# EAGLE design GAGAN_payload_V5 (EAGLE 9.3.2)
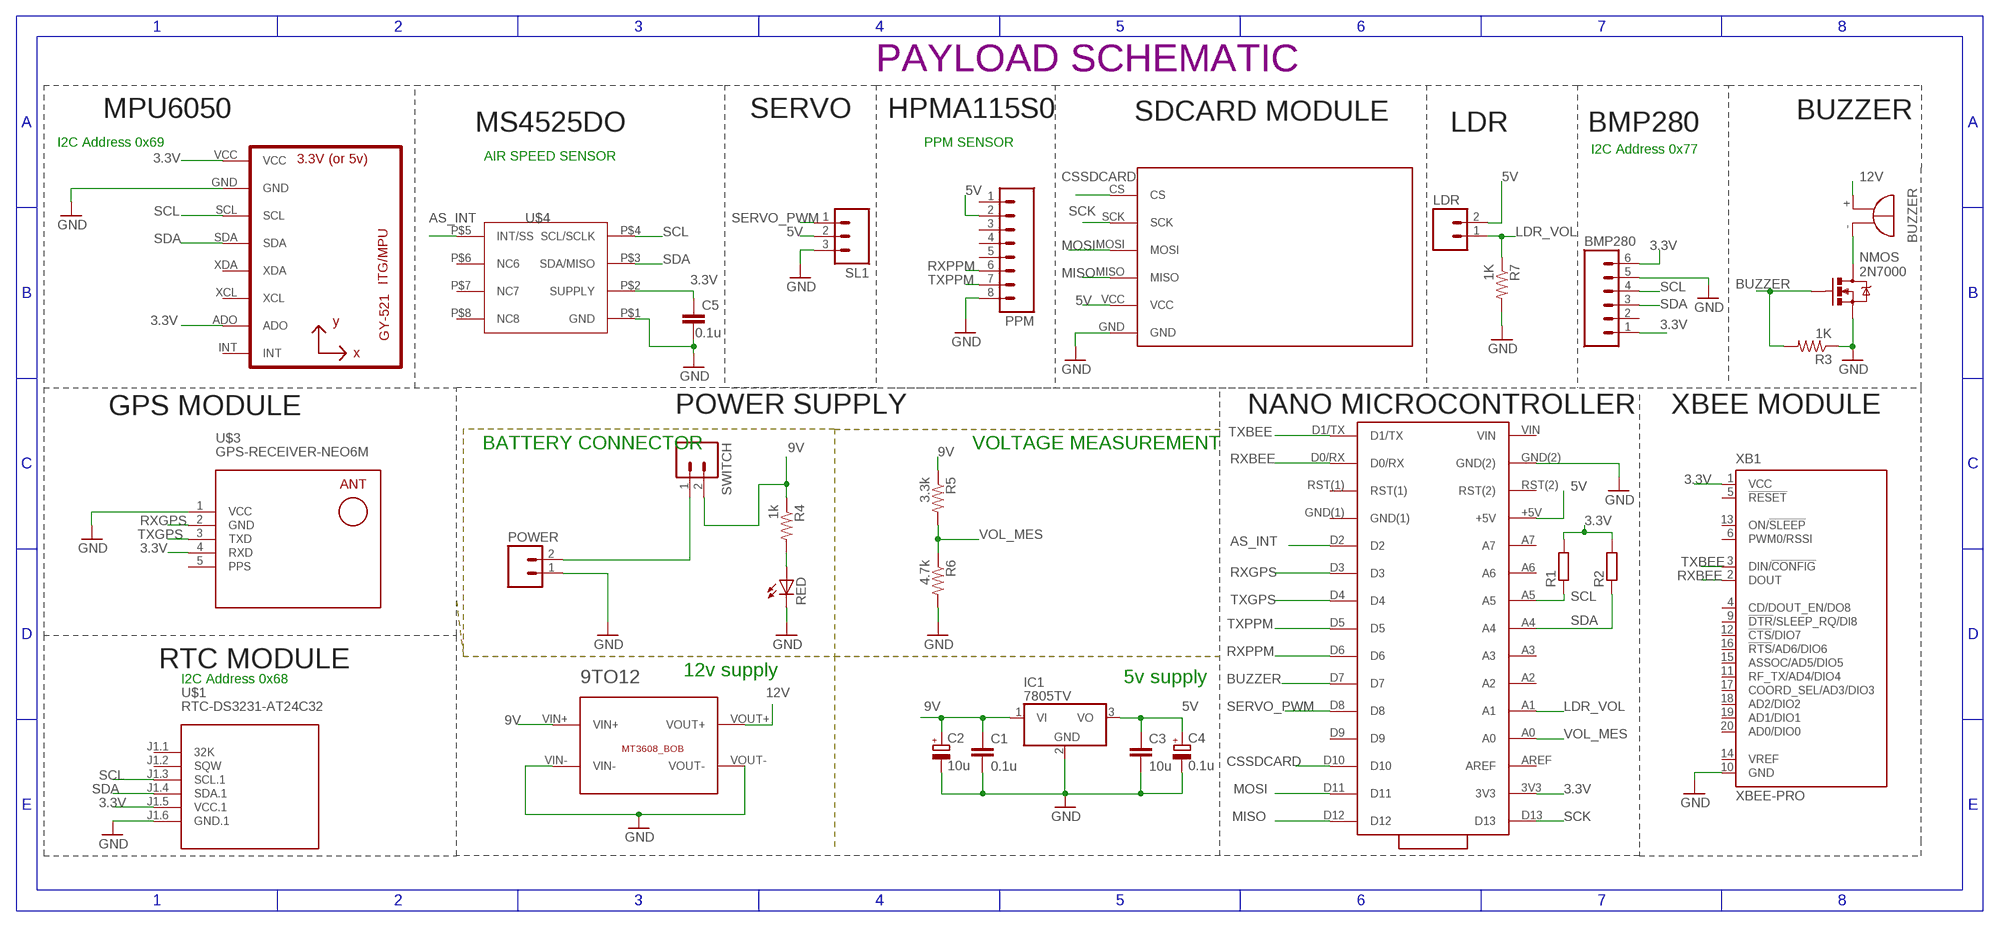
[diagram p0: schematic, sheet 1]

## Parts
9TO12  BREAKOUTS_MT3608_BOB  [BREAKOUTS_MT3608_BOB]
BMP280  M06  [06P]
C1  0.1u  C-EU025-025X050  [C025-025X050]
C2  10u  CPOL-EUE2.5-6  [E2,5-6]
C3  10u  C-EU025-025X050  [C025-025X050]
C4  0.1u  CPOL-EUE2.5-6  [E2,5-6]
C5  0.1u  C-EU025-025X050  [C025-025X050]
IC1  7805TV  [TO220V]
LDR  M02  [02P]
MOD1  ARDUINO(NANO_3.0)  [ARDUINO_NANO_30PIN]
POWER  CEDT_JANUARY_2015_V5_M02  [CEDT_JANUARY_2015_V5_02P]
PPM  M08  [08P]
Q1  SPARKFUN-DISCRETESEMI_MOSFET-NCHANNEL2N7000  [SPARKFUN-DISCRETESEMI_TO-92]
R1  R-EU_0207/7  [0207/7]
R2  R-EU_0207/7  [0207/7]
R3  1K  R-US_0204/7  [0204/7]
R4  1k  R-US_0204/7  [0204/7]
R5  3.3k  R-US_0204/7  [0204/7]
R6  4.7k  R-US_0204/7  [0204/7]
R7  1K  R-US_0204/7  [0204/7]
RED  red  LED3MM  [LED3MM]
SG1  BUZZER_EB2209A  [BUZZER_EB2209A]
SL1  M03  [03P]
SWITCH  M02  [02P]
U1  GY-521MPU6050  [GY-521]
U$1  RTC-DS3231-AT24C32  [RTC-DS3231-AT24C32]
U$3  GPS-RECEIVER-NEO6M  [GPS-RECEIVER-NEO6M]
U$4  MS4525DO  [MS4525DO]
U$5  SDCARD  [M0SDCARDMODULE]
XB1  XBEE-PRO  [XBEE-PRO]

## Nets
3.3V [power]: BMP280.1 BMP280.6 C5.1 MOD1.3V3 R1.2 R2.2 U1.ADO U1.VCC U$1.J1.5(VCC.1) U$3.4(RXD) U$4.P$2(SUPPLY) XB1.1(VCC)
5V [power]: C3.1 C4.+ IC1.3(VO) LDR.2 MOD1.+5V PPM.2 SL1.2 U$5.VCC
9V [power]: 9TO12.VIN+ C1.1 C2.+ IC1.1(VI) R4.1 R5.1 SWITCH.2
12V [power]: 9TO12.VOUT+ SG1.+
AS_INT: MOD1.D2 U$4.P$5(INT/SS)
BUZZER: MOD1.D7 Q1.2(G) R3.2
CSSDCARD: MOD1.D10 U$5.CS
GND [power]: 9TO12.VIN- 9TO12.VOUT- BMP280.5 C1.2 C2.- C3.2 C4.- C5.2 IC1.2(GND) MOD1.GND(2) POWER.1 PPM.8 Q1.1(S) R3.1 R6.2 R7.2 RED.K(C) SL1.3 U1.GND U$1.J1.6(GND.1) U$3.1(VCC) U$4.P$1(GND) U$5.GND XB1.10(GND)
LDR_VOL: LDR.1 MOD1.A1 R7.1
MISO: MOD1.D12 U$5.MISO
MOSI: MOD1.D11 U$5.MOSI
N$1 [power]: POWER.2 SWITCH.1
N$2: R4.2 RED.A
N$3 [power]: Q1.3(D) SG1.-
RXBEE: MOD1.D0/RX XB1.2(DOUT)
RXGPS: MOD1.D3 U$3.2(GND)
RXPPM: MOD1.D6 PPM.6
SCK: MOD1.D13 U$5.SCK
SCL: BMP280.4 MOD1.A5 R1.1 U1.SCL U$1.J1.3(SCL.1) U$4.P$4(SCL/SCLK)
SDA: BMP280.3 MOD1.A4 R2.1 U1.SDA U$1.J1.4(SDA.1) U$4.P$3(SDA/MISO)
SERVO_PWM: MOD1.D8 SL1.1
TXBEE: MOD1.D1/TX XB1.3(DIN/!CONFIG)
TXGPS: MOD1.D4 U$3.3(TXD)
TXPPM: MOD1.D5 PPM.7
VOL_MES: MOD1.A0 R5.2 R6.1
Unconnected: BMP280.2 MOD1.A2 MOD1.A3 MOD1.A6 MOD1.A7 MOD1.AREF MOD1.D9 MOD1.GND(1) MOD1.RST(1) MOD1.RST(2) MOD1.VIN PPM.1 PPM.3 PPM.4 PPM.5 U1.INT U1.XCL U1.XDA U$1.J1.1(32K) U$1.J1.2(SQW) U$4.P$6(NC6) U$4.P$7(NC7) U$4.P$8(NC8) XB1.4(CD/DOUT_EN/DO8) XB1.5(!RESET) XB1.6(PWM0/RSSI) XB1.9(!DTR!/SLEEP_RQ/DI8) XB1.11(RF_TX/AD4/DIO4) XB1.12(!CTS!/DIO7) XB1.13(ON/!SLEEP) XB1.14(VREF) XB1.15(ASSOC/AD5/DIO5) XB1.16(!RTS!/AD6/DIO6) XB1.17(COORD_SEL/AD3/DIO3) XB1.18(AD2/DIO2) XB1.19(AD1/DIO1) XB1.20(AD0/DIO0)

## Notes on the sheet
- PAYLOAD SCHEMATIC
- MPU6050 | SERVO | HPMA115S0 | SDCARD MODULE | BUZZER
- MS4525DO | LDR | BMP280
- I2C Address 0x69 | PPM SENSOR
- I2C Address 0x77
- AIR SPEED SENSOR
- GPS MODULE | POWER SUPPLY | NANO MICROCONTROLLER | XBEE MODULE
- BATTERY CONNECTOR | VOLTAGE MEASUREMENT
- RTC MODULE
- 12v supply
- I2C Address 0x68 | 5v supply

## Power pins joined to a net without a drawn wire
PPS: U$3.5(PPS)

## Library data of the parts
9TO12 = Cansat2019_3279_Container_v01:BREAKOUTS_MT3608_BOB
BMP280 = con-amp-quick:M06: AMP QUICK CONNECTOR; OC_FARNELL: unknown; OC_NEWARK: unknown
C1 C3 C5 = resistor:C-EU: CAPACITOR, European symbol
C2 C4 = rcl:CPOL-EU: POLARIZED CAPACITOR, European symbol
IC1 = linear:78*: Positive VOLTAGE REGULATOR Source: http://cache.national.com/ds/LM/LM78L05.pdf http://www.fairchildsemi.com/ds/LM/LM7805.pdf
LDR = con-amp-quick:M02: AMP QUICK CONNECTOR; OC_FARNELL: unknown; OC_NEWARK: unknown
MOD1 = Arduino_Nano_3:ARDUINO(NANO_3.0)
POWER = Cansat2019_3279_Container_v01:CEDT_JANUARY_2015_V5_M02: AMP QUICK CONNECTOR
PPM = con-amp-quick:M08: AMP QUICK CONNECTOR; OC_FARNELL: unknown; OC_NEWARK: unknown
Q1 = Cansat2019_3279_Container_v01:SPARKFUN-DISCRETESEMI_MOSFET-NCHANNEL: Common NMOSFET Parts MFG P/N Store ID Prod ID FDD8780 TRANS-09984 SI7820DN TRANS-11055 FDS6630A IC-08089 2N7002PW TRANS-11151 FQP30N06L COM-10213 TRANS-10060 BSS123LT1G TRANS-08345 BSS138 TRANS-00830 BS170 2N7000
R1 R2 = rcl:R-EU_: RESISTOR, European symbol; SPICEPREFIX: R
R3-R7 = rcl:R-US_: RESISTOR, American symbol
RED = CEDT_JANUARY_2015_v5:LED
SG1 = Cansat2019_3279_Container_v01:BUZZER_EB2209A: BUZZER Source: Buerklin; OC_FARNELL: unknown; OC_NEWARK: unknown
SL1 = con-amp-quick:M03: AMP QUICK CONNECTOR; OC_FARNELL: unknown; OC_NEWARK: unknown
SWITCH = CEDT_JANUARY_2015_v5:M02: AMP QUICK CONNECTOR
U1 = gy-521:GY-521
U$1 = diy-modules:RTC-DS3231-AT24C32: RTC Module with Battery and EEPROM based on DS3231 and AT24C32 chips Tutorial can be found here: https://edwardmallon.wordpress.com/2014/05/21/using-a-cheap-3-ds3231-rtc-at24c32-eeprom-from-ebay/ Click here to find device on ebay.com <http://www.ebay.com/sch/DS3231+AT24C32+module>
U$3 = diy-modules:GPS-RECEIVER-NEO6M: GPS Receiver Module based on NEO-6 device Short tutorial how to use NEO-6 module with Arduino: http://www.xarg.org/2016/06/neo6mv2-gps-module-with-arduino/ NEO-6 datasheet is available here: https://www.u-blox.com/sites/default/files/products/documents/NEO-6_DataSheet_%28GPS.G6-HW-09005%29.pdf Click here to find device on ebay.com <http://www.ebay.com/sch/gyneo6mv2>
U$4 = MS4525:MS4525DO
U$5 = mylib:SDCARD
XB1 = maxstream:XBEE: XBee (TM) /XBee-PRO(TM) OEM RF Modules Source: MaxStream, Inc. xbee_productmanual.pdf; MPN: XBP24-AWI-001; OC_FARNELL: 1337916; OC_NEWARK: 42M2667

## Net classes
0 default: width 0.61 mm
1 power: width 0.61 mm

## Board
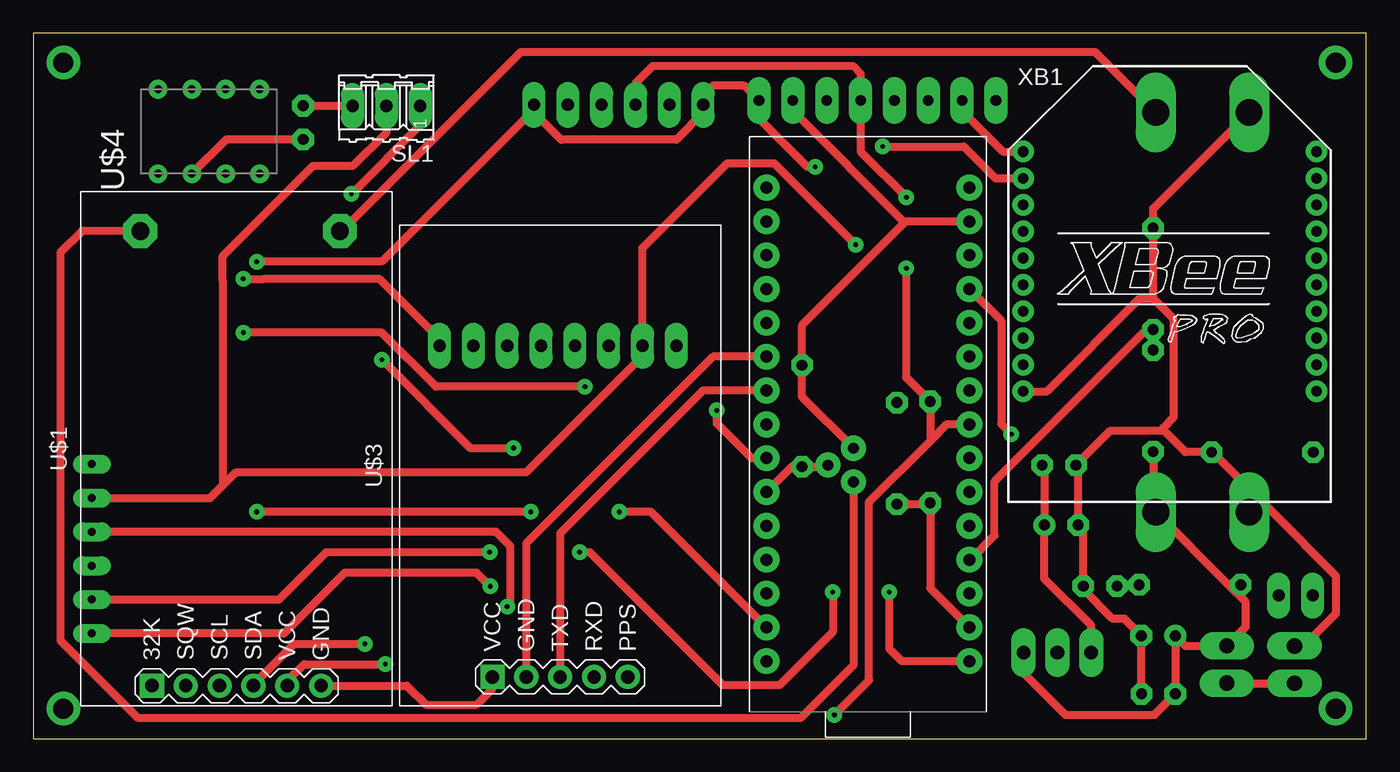
[diagram p1: board, top side]
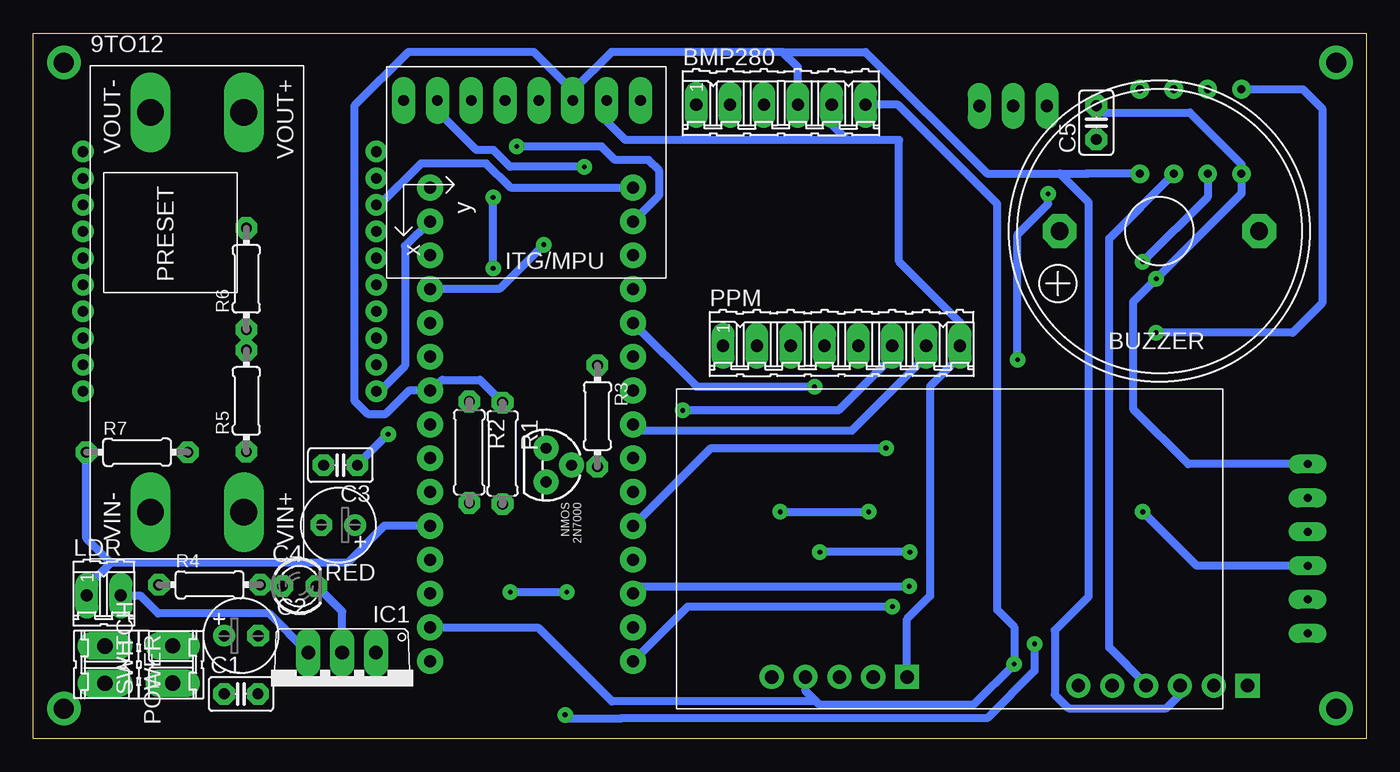
[diagram p2: board, bottom side, seen from below]

Size 100.04 x 52.95 mm. Coordinates in mm from the lower left corner, seen from the top.
Outline: 0,0 100.04,0 100.04,52.95 0,52.95 0,0
Copper layers (1*16): Top 0.035mm / dielectric 1.5mm / Bottom 0.035mm
Design rules "default *": minimum track width 6mil, minimum drill 0.35mm, track to track 16mil, track to pad 16mil, pad to pad 16mil, via to via 16mil, smd to smd 16mil, copper to edge 40mil, drill to drill 6mil, minimum pad ring 16mil, minimum via ring 16mil, stop-mask expansion 4mil, vias tented up to drill 0mil, thermal gap 10mil

### Footprints (pad centres in the part's own frame; a part is rotated, then mirrored left to right if it is on the bottom)
BREAKOUTS_MT3608_BOB = drill 2 pad 3 long: VIN+ 33.5,-4.5; VIN- 33.5,-11.5; VOUT+ 3.5,-4.5; VOUT- 3.5,-11.5
06P = drill 0.914 long: 1 -6.35,0; 2 -3.81,0; 3 -1.27,0; 4 1.27,0; 5 3.81,0; 6 6.35,0
C025-025X050 = drill 0.813 octagon: 1 -1.27,0; 2 1.27,0
E2,5-6 = drill 0.813 pad 1.6: + -1.27,0 | drill 0.813 pad 1.6 octagon: - 1.27,0
TO220V = drill 1.016 long: 1 -2.54,-2.54; 2 0,-2.54; 3 2.54,-2.54
02P = drill 0.914 long: 1 -1.27,0; 2 1.27,0
ARDUINO_NANO_30PIN = drill 0.9 pad 1.93: 3V3 16.51,6.35; +5V 16.51,31.75; A0 16.51,11.43; A1 16.51,13.97; A2 16.51,16.51; A3 16.51,19.05; A4 16.51,21.59; A5 16.51,24.13; A6 16.51,26.67; A7 16.51,29.21; AREF 16.51,8.89; D0/RX 1.27,36.83; D1/TX 1.27,39.37; D2 1.27,29.21; D3 1.27,26.67; D4 1.27,24.13; D5 1.27,21.59; D6 1.27,19.05; D7 1.27,16.51; D8 1.27,13.97; D9 1.27,11.43; D10 1.27,8.89; D11 1.27,6.35; D12 1.27,3.81; D13 16.51,3.81; GND(1) 1.27,31.75; GND(2) 16.51,36.83; RST(1) 1.27,34.29; RST(2) 16.51,34.29; VIN 16.51,39.37
CEDT_JANUARY_2015_V5_02P = drill 1.143 long: 1 -1.397,0; 2 1.397,0
08P = drill 0.914 long: 1 -8.89,0; 2 -6.35,0; 3 -3.81,0; 4 -1.27,0; 5 1.27,0; 6 3.81,0; 7 6.35,0; 8 8.89,0
SPARKFUN-DISCRETESEMI_TO-92 = drill 0.813 pad 1.88: 1 -1.27,0; 2 0,1.905; 3 1.27,0
0207/7 = drill 0.813 octagon: 1 -3.81,0; 2 3.81,0
0204/7 = drill 0.813 octagon: 1 -3.81,0; 2 3.81,0
LED3MM = drill 0.813 octagon: A -1.27,0; K 1.27,0
BUZZER_EB2209A = drill 1.321 pad 2.54 octagon: + 7.493,0; - -7.493,0
03P = drill 0.914 long: 1 -2.54,0; 2 0,0; 3 2.54,0
02P' = drill 1.143 long: 1 -1.397,0; 2 1.397,0
GY-521 = drill 0.8 pad 1.778 long: ADO -8.89,-6.35; GND -8.89,6.35; INT -8.89,-8.89; SCL -8.89,3.81; SDA -8.89,1.27; VCC -8.89,8.89; XCL -8.89,-3.81; XDA -8.89,-1.27
RTC-DS3231-AT24C32 = drill 1 square: J1.1 -17.78,6.35 | drill 1: J1.2 -17.78,3.81; J1.3 -17.78,1.27; J1.4 -17.78,-1.27; J1.5 -17.78,-3.81; J1.6 -17.78,-6.35
GPS-RECEIVER-NEO6M = drill 1 square: 1 -15.875,5.08 | drill 1: 2 -15.875,2.54; 3 -15.875,0; 4 -15.875,-2.54; 5 -15.875,-5.08
MS4525DO = drill 0.6: P$1 -6.35,8.89; P$2 -6.35,6.35; P$3 -6.35,3.81; P$4 -6.35,1.27; P$5 0,8.89; P$6 0,6.35; P$7 0,3.81; P$8 0,1.27
M0SDCARDMODULE = drill 0.6 long: CS -6.35,6.35; GND -6.35,-6.35; MISO -6.35,-1.27; MOSI -6.35,1.27; SCK -6.35,3.81; VCC -6.35,-3.81
XBEE-PRO = drill 0.8 pad 1.27: 1 -11,9; 2 -11,7; 3 -11,5; 4 -11,3; 5 -11,1; 6 -11,-1; 7 -11,-3; 8 -11,-5; 9 -11,-7; 10 -11,-9; 11 11,-9; 12 11,-7; 13 11,-5; 14 11,-3; 15 11,-1; 16 11,1; 17 11,3; 18 11,5; 19 11,7; 20 11,9

### Placement (x,y rotation side)
9TO12  79.75,50.5 270 bottom
BMP280  43.93,47.58 0 bottom
C1  84.45,3.35 0 bottom
C2  84.44,7.72 0 bottom
C3  76.99,20.53 180 bottom
C4  77.15,16.03 180 bottom
C5  20.25,46.25 90 bottom
IC1  76.86,3.91 180 bottom
LDR  94.75,10.75 0 bottom
MOD1  53.75,2 0 top
POWER  94.67,5.55 270 bottom
PPM  39.38,29.49 0 bottom
Q1  61.55,20.53 270 bottom
R1  64.82,21.41 270 bottom
R2  67.32,21.5 270 bottom
R3  57.7,24.22 270 bottom
R4  86.81,11.55 0 bottom
R5  84.05,25.35 90 bottom
R6  84.05,34.51 90 bottom
R7  92.25,21.5 0 bottom
RED  80.07,11.45 0 bottom
SG1  15.52,38.1 180 bottom
SL1  26.5,47.5 180 top
SWITCH  [02P']  89.58,5.56 90 bottom
U1  63.36,39.03 270 bottom
U$1  15.25,21.75 90 top
U$3  39.54,20.5 90 top
U$4  18.25,48.75 90 top
U$5  10.75,14.25 180 bottom
XB1  85.3,35.07 0 top

### Tracks (layer width: path | path; a pad name or v marks a point on that pad's centre or on a via)
3.3V  (via drill 0.35)
  Top 0.61: v26.42,5.59 20.33,5.59 19.06,4.32 U$1.J1.5 | XB1.1 72.77,44.07 69.71,47.13 U1.ADO | R1.2 67.23,17.6 R2.2 67.32,11.29 MOD1.3V3 | v58.67,42.93 58.07,42.93 54.47,46.53 U1.VCC 53.39,49 51,49 50.28,48.28 BMP280.1 50.28,46.98 48.26,44.96 39.62,44.96 37.58,47 BMP280.6 37.58,47.23 26.17,35.82 16.78,35.82 v16.76,35.8 | C5.1 14.48,44.98 U$4.P$2
  Bottom 0.61: v58.67,42.93 64.26,42.93 65.53,44.2 66.8,44.2 69.71,47.1 U1.ADO | MOD1.3V3 62.17,8.35 56.61,2.79 41.29,2.79 | U$3.4 42.08,3.58 41.29,2.79 | 41.29,2.79 41.04,2.54 29.46,2.54 v26.42,5.59 26.42,8.38 27.69,9.65 27.69,40.13 35.13,47.58 BMP280.6 | U$4.P$2 11.9,40.67 v16.76,35.8
5V  (via drill 0.35)
  Top 0.61: v73.41,22.86 72.64,23.62 72.64,31.37 MOD1.+5V | C3.1 75.88,20.37 C4.+ 75.88,12 79.4,8.48 IC1.3 | v61.72,37.08 55.63,43.18 52.07,43.18 45.72,36.83 45.72,29.72 45.73,29.71 PPM.2 45.73,28.71 37.02,20 15.23,20 14.23,19 | 14.23,19 14.23,34 14.23,34.3 14.23,36.23 21,43 24,43 26.5,45.5 26.5,46.57 26.5,47 SL1.2 | U$5.VCC 13.29,18.06 14.23,19
  Bottom 0.61: C3.1 75.72,20.55 v73.41,22.86 | LDR.2 92.03,10.75 90.68,9.4 82.35,9.4 IC1.3 | v61.72,37.08 65.06,33.75 MOD1.+5V
9V
  Top 0.61: R5.1 84.05,17.2 9TO12.VIN+ 89.7,11.55 | 89.7,11.55 R4.1 | 89.7,11.55 91,10.25 91,8.38 SWITCH.2 86.47,6.96 C2.+ C1.1 84.15,1.78 77.47,1.78 74.32,4.93 IC1.1
12V
  Top 0.61: SG1.+ 23.13,38.1 36.58,51.55 79.7,51.55 9TO12.VOUT+
AS_INT  (via drill 0.35)
  Top 0.61: v15.76,30.48 26.16,30.48 30.22,26.42 v41.41,26.42
  Bottom 0.61: 50.3,26.42 50.23,26.42 | v41.41,26.42 50,26.42 50.23,26.42 | U$4.P$5 4.75,48.75 3.3,47.3 3.3,32.7 5.52,30.48 v15.76,30.48 | MOD1.D2 50.23,26.42
BUZZER
  Top 0.61: MOD1.D7 56.92,20.41 R3.2 59.52,20.41 Q1.2
CSSDCARD  (via drill 0.35)
  Top 0.61: U$5.CS 18.82,7.9 23.38,12.45 33.27,12.45 v34.29,11.43
  Bottom 0.61: v34.29,11.43 54.61,11.43 55.02,11.02 MOD1.D10
GND  (via drill 0.35)
  Top 0.61: 84.84,23.11 80.84,23.11 C3.2 78.42,20.37 C4.- 78.8,15.65 RED.K 78.8,11.2 81,9 81.89,9 C2.- C1.2 | 84.07,33.02 85.6,31.5 85.6,24.13 84.84,23.37 84.84,23.11 | U$3.1 34.46,3.74 33.26,2.54 29.46,2.54 28.03,3.97 U$1.J1.6 | 65.28,38.61 65.28,38.86 57.01,47.13 U1.GND | 84.07,33.02 84.05,33.04 R6.2 84.05,39.8 9TO12.VOUT- | 65.28,38.61 57.7,31.03 R3.1 57.7,25.61 57.74,25.61 Q1.1 | MOD1.GND(2) 65.5,38.83 65.28,38.61 | XB1.10 76.07,26.07 83.02,33.02 84.07,33.02 | 84.84,23.11 86.45,21.5 R7.2 88.48,21.5 92.98,17 | 92.98,17 9TO12.VIN- | 92.98,17 97.79,12.19 97.79,9.4 95.34,6.95 POWER.1 | PPM.8 30.49,29.99 25.95,34.53 17.32,34.53 17.3,34.51 16.23,34.51 16.21,34.53 v15.75,34.53 | C5.2 23.94,47.52 SL1.3
  Bottom 0.61: 38.96,44.96 55.61,44.96 57.01,46.35 U1.GND | BMP280.5 40.12,46.12 38.96,44.96 | 38.96,44.96 35.05,44.96 35.05,35.81 30.49,31.25 PPM.8 30.49,28.69 32.74,26.44 32.74,10.7 34.46,8.98 U$3.1 | XB1.10 74.05,26.07 72.14,27.98 72.14,37 72.09,37 MOD1.GND(2) | RED.K 78.76,11.45 76.86,9.55 IC1.2 | U$5.GND 13.35,20.6 17.5,24.75 17.5,32.78 v15.75,34.53 9.36,40.92 U$4.P$1 9.36,43.13 13.23,47 19.73,47 C5.2
LDR_VOL
  Bottom 0.61: 94.23,13.21 76.45,13.21 73.69,15.97 MOD1.A1 | 94.23,13.21 96.01,11.43 LDR.1 | 94.23,13.21 96.06,15.03 R7.1
MISO  (via drill 0.35)
  Top 0.61: v35.56,9.91 35.82,10.16 35.82,14.44 34.74,15.52 U$5.MISO
  Bottom 0.61: v35.56,9.91 50.92,9.91 MOD1.D12
MOSI  (via drill 0.35)
  Top 0.61: v37.34,17.02 v16.76,17.02 | MOD1.D11 46.35,17.02 v43.98,17.02
  Bottom 0.61: v43.98,17.02 v37.34,17.02 | U$5.MOSI 12.73,12.98 v16.76,17.02
N$1
  Top 0.61: SWITCH.1 94.66,4.16 POWER.2
N$2
  Bottom 0.61: RED.A 82.9,11.45 R4.2
N$3
  Top 0.61: SG1.- 3.66,38.1 2.03,36.47 2.03,7.37 7.87,1.52 57.59,1.52 61.55,5.48 Q1.3
N$4  (via drill 1.5)
  other vias: 2.25,50.75
N$5  (via drill 1.5)
  other vias: 2.25,2.25
N$6  (via drill 1.5)
  other vias: 97.75,50.75
N$7  (via drill 1.5)
  other vias: 97.75,2.25
RXBEE  (via drill 0.35)
  Top 0.61: v63.75,44.45 69.85,44.45 72.23,42.07 XB1.2
  Bottom 0.61: v63.75,44.45 57.38,44.45 56.36,43.43 53.86,43.43 53.09,42.66 53.09,40.76 MOD1.D0/RX
RXGPS
  Top 0.61: U$3.2 37,14.64 51.03,28.67 MOD1.D3
RXPPM  (via drill 0.35)
  Top 0.61: v51.31,24.64 51.31,23.64 53.9,21.05 MOD1.D6
  Bottom 0.61: v51.31,24.64 39.62,24.64 35.57,28.69 PPM.6
SCK  (via drill 0.35)
  Top 0.61: MOD1.D13 65.19,5.81 64.25,6.75 v64.25,11 | v60,11 60,8 56,4 51.75,4 41.75,14 v41,14 | U$5.SCK 18.44,10.44 22,14 v34.25,14
  Bottom 0.61: v64.25,11 v60,11 | v34.25,14 v41,14
SCL
  Bottom 0.61: R1.1 66.52,26.92 69.34,26.92 70.14,26.13 MOD1.A5 71.84,26.13 73.59,24.38 74.93,24.38 75.95,25.4 75.95,47.5 71.9,51.55 62.47,51.55 59.69,48.77 59.69,48.06 U1.SCL 59.55,48.65 56.66,51.55 43.8,51.55 | 23,42.42 28.45,42.42 37.58,51.55 43.8,51.55 | 23,42.42 21,42.42 | 21,42.42 20.83,42.42 | U$1.J1.3 13.98,3.3 15,2.29 22.35,2.29 23.37,3.3 23.37,8.13 20.83,10.67 20.83,40.25 23,42.42 | BMP280.4 42.66,50.41 43.8,51.55 | U$4.P$4 20.98,42.4 21,42.42
SDA  (via drill 0.35)
  Top 0.61: 67.32,22.36 62.73,17.78 62.73,4.39 v60.13,1.78 | v24.89,7.11 19.56,7.11 16.52,4.07 U$1.J1.4 | v65.53,40.64 62.09,44.08 U1.SDA 62.09,49.91 61.5,50.5 46.5,50.5 45.2,49.2 BMP280.3 | 67.32,22.36 R2.1 65.53,27.1 v65.53,35.31 | MOD1.A4 68.55,23.59 67.32,22.36
  Bottom 0.61: v65.53,35.31 v65.53,40.64 | U$1.J1.4 16.52,4.07 19.29,6.84 19.29,37.55 U$4.P$3 | v60.13,1.78 59.88,1.53 55.87,1.53 55.86,1.52 28.45,1.52 24.89,5.08 v24.89,7.11
SERVO_PWM  (via drill 0.35)
  Top 0.61: v26.16,28.45 32.79,21.82 v36.04,21.82 | SL1.1 29.04,46.06 v23.88,40.89
  Bottom 0.61: v23.88,40.89 23.88,40.13 26.16,37.85 v26.16,28.45 | MOD1.D8 49.17,21.82 v36.04,21.82
TXBEE
  Bottom 0.61: XB1.3 74.05,40.07 70.94,43.18 66.04,43.18 64.23,41.37 MOD1.D1/TX
TXGPS
  Top 0.61: U$3.3 39.54,15.41 50.26,26.13 MOD1.D4
TXPPM
  Bottom 0.61: PPM.7 33.03,28.69 38.61,23.11 54.54,23.11 MOD1.D5
VOL_MES
  Top 0.61: R5.2 R6.1 83.53,30.7 72.14,19.3 72.14,15.24 70.33,13.43 MOD1.A0